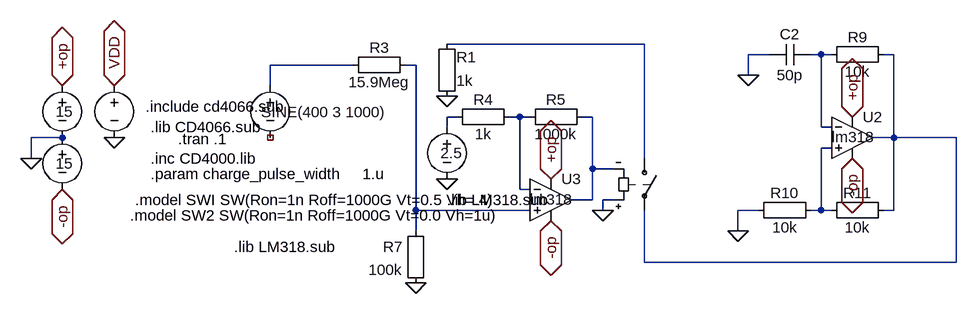
[diagram p0: schematic metal_SMPS_400v_100_pwm_control+generator.asc]
metal_SMPS_400v_100_pwm_control+generator.asc, the LTspice schematic file:
Version 4
SHEET 1 6068 1612
WIRE 3568 -3088 3264 -3088
WIRE 3760 -3072 3728 -3072
WIRE 3840 -3072 3824 -3072
WIRE 3856 -3072 3840 -3072
WIRE 3952 -3072 3936 -3072
WIRE 3120 -3056 2992 -3056
WIRE 3216 -3056 3200 -3056
WIRE 3728 -3040 3728 -3072
WIRE 2992 -3024 2992 -3056
WIRE 3280 -2976 3264 -2976
WIRE 3376 -2976 3360 -2976
WIRE 3392 -2976 3376 -2976
WIRE 3488 -2976 3472 -2976
WIRE 3264 -2960 3264 -2976
WIRE 3840 -2960 3840 -3072
WIRE 3856 -2960 3840 -2960
WIRE 2672 -2944 2624 -2944
WIRE 3952 -2944 3952 -3072
WIRE 3952 -2944 3920 -2944
WIRE 4048 -2944 3952 -2944
WIRE 3856 -2928 3840 -2928
WIRE 2624 -2912 2624 -2944
WIRE 3568 -2912 3568 -3088
WIRE 3488 -2896 3488 -2976
WIRE 3520 -2896 3488 -2896
WIRE 3376 -2864 3376 -2976
WIRE 3392 -2864 3376 -2864
WIRE 3488 -2848 3488 -2896
WIRE 3488 -2848 3456 -2848
WIRE 3520 -2848 3504 -2848
WIRE 3216 -2832 3216 -3056
WIRE 3392 -2832 3216 -2832
WIRE 3504 -2832 3504 -2848
WIRE 3744 -2832 3712 -2832
WIRE 3840 -2832 3840 -2928
WIRE 3840 -2832 3824 -2832
WIRE 3856 -2832 3840 -2832
WIRE 3952 -2832 3952 -2944
WIRE 3952 -2832 3936 -2832
WIRE 3216 -2800 3216 -2832
WIRE 3712 -2800 3712 -2832
WIRE 3568 -2752 3568 -2832
WIRE 4048 -2752 4048 -2944
WIRE 4048 -2752 3568 -2752
FLAG 2752 -2944 0
FLAG 2752 -3024 VDD
IOPIN 2752 -3024 BiDir
FLAG 3424 -2880 +op
IOPIN 3424 -2880 BiDir
FLAG 3424 -2816 -op
IOPIN 3424 -2816 BiDir
FLAG 2624 -2912 0
FLAG 2672 -3024 +op
IOPIN 2672 -3024 BiDir
FLAG 2672 -2864 -op
IOPIN 2672 -2864 BiDir
FLAG 3264 -2880 0
FLAG 3216 -2720 0
FLAG 3504 -2832 0
FLAG 3264 -3008 0
FLAG 3888 -2976 +op
IOPIN 3888 -2976 BiDir
FLAG 3888 -2912 -op
IOPIN 3888 -2912 BiDir
FLAG 3728 -3040 0
FLAG 3712 -2800 0
SYMBOL voltage 2752 -3040 R0
WINDOW 39 0 0 Left 2
WINDOW 0 24 16 Invisible 2
WINDOW 3 24 96 Invisible 2
SYMATTR InstName V7
SYMATTR Value 5
SYMBOL Opamps\\opamp2 3424 -2912 R0
WINDOW 3 -32 63 Left 2
SYMATTR Value lm318
SYMATTR InstName U3
SYMBOL voltage 2672 -2960 R0
WINDOW 0 24 16 Invisible 2
WINDOW 3 -10 56 Left 2
SYMATTR InstName V2
SYMATTR Value 15
SYMATTR SpiceLine Rser=0
SYMBOL voltage 2672 -3040 R0
WINDOW 0 24 16 Invisible 2
WINDOW 3 -10 56 Left 2
SYMATTR InstName V1
SYMATTR Value 15
SYMATTR SpiceLine Rser=0
SYMBOL Misc\\EuropeanResistor 3216 -3040 M270
WINDOW 0 27 56 VTop 2
WINDOW 3 5 56 VBottom 2
SYMATTR InstName R3
SYMATTR Value 15.9Meg
SYMBOL Misc\\EuropeanResistor 3376 -2960 M270
WINDOW 0 27 56 VTop 2
WINDOW 3 5 56 VBottom 2
SYMATTR InstName R4
SYMATTR Value 1k
SYMBOL Misc\\EuropeanResistor 3488 -2960 M270
WINDOW 0 27 56 VTop 2
WINDOW 3 5 56 VBottom 2
SYMATTR InstName R5
SYMATTR Value 1000k
SYMBOL voltage 3264 -2976 R0
WINDOW 0 24 16 Invisible 2
WINDOW 3 -10 56 Left 2
WINDOW 123 0 0 Left 2
SYMATTR InstName V3
SYMATTR Value 2.5
SYMATTR SpiceLine Rser=0
SYMBOL Misc\\EuropeanResistor 3232 -2816 M0
SYMATTR InstName R7
SYMATTR Value 100k
SYMBOL sw 3568 -2928 R0
WINDOW 0 13 4 Invisible 2
SYMATTR InstName S2
SYMATTR SpiceModel SW2
SYMATTR Value ""
SYMBOL Misc\\EuropeanResistor 3248 -2992 M180
WINDOW 0 31 76 Left 2
WINDOW 3 31 40 Left 2
SYMATTR InstName R1
SYMATTR Value 1k
SYMBOL Opamps\\opamp2 3888 -3008 R0
WINDOW 3 -32 63 Left 2
SYMATTR Value lm318
SYMATTR InstName U2
SYMBOL Misc\\EuropeanResistor 3952 -3056 M270
WINDOW 0 27 56 VTop 2
WINDOW 3 5 56 VBottom 2
SYMATTR InstName R9
SYMATTR Value 10k
SYMBOL Misc\\EuropeanResistor 3840 -2816 M270
WINDOW 0 27 56 VTop 2
WINDOW 3 5 56 VBottom 2
SYMATTR InstName R10
SYMATTR Value 10k
SYMBOL Misc\\EuropeanResistor 3952 -2816 M270
WINDOW 0 27 56 VTop 2
WINDOW 3 5 56 VBottom 2
SYMATTR InstName R11
SYMATTR Value 10k
SYMBOL Misc\\EuropeanCap 3824 -3088 R90
WINDOW 0 0 32 VBottom 2
WINDOW 3 32 32 VTop 2
SYMATTR InstName C2
SYMATTR Value 50p
SYMATTR SpiceLine Rser=.0008
SYMBOL voltage 2992 -3040 R0
WINDOW 123 0 0 Left 2
WINDOW 0 24 16 Invisible 2
WINDOW 3 -14 57 Left 2
SYMATTR InstName V4
SYMATTR Value SINE(400 3 1000)
SYMATTR SpiceLine Rser=0
TEXT 2784 -2848 Left 2 !.model SWI SW(Ron=1n Roff=1000G Vt=0.5 Vh=.4)
TEXT 3264 -2848 Left 2 !.lib LM318.sub
TEXT 2776 -2824 Left 2 !.model SW2 SW(Ron=1n Roff=1000G Vt=0.0 Vh=1u)
TEXT 2808 -2888 Left 2 !.param charge_pulse_width     1.u
TEXT 2936 -2776 Left 2 !.lib LM318.sub
TEXT 2808 -2960 Left 2 !.lib CD4066.sub
TEXT 2808 -2912 Left 2 !.inc CD4000.lib
TEXT 2800 -2992 Left 2 !.include cd4066.sub
TEXT 2850 -2942 Left 2 !.tran .1

The netlist it stands for:
* metal_SMPS_400v_100_pwm_control+generator.asc
V7 VDD 0 5
XU3 N005 N007 +op -op N008 lm318  ; pins In+ In- V+ V- OUT
V2 0 -op 15 Rser=0
V1 +op 0 15 Rser=0
R3 N005 N004 15.9Meg
R4 N007 N006 1k
R5 N008 N007 1000k
V3 N006 0 2.5 Rser=0
R7 N005 0 100k
S2 N001 N003 0 N008 SW2
R1 0 N001 1k
XU2 N009 N002 +op -op N003 lm318  ; pins In+ In- V+ V- OUT
R9 N003 N002 10k
R10 N009 0 10k
R11 N003 N009 10k
C2 N002 0 50p Rser=.0008
V4 N004 NC_01 SINE(400 3 1000) Rser=0
.model SWI SW(Ron=1n Roff=1000G Vt=0.5 Vh=.4)
.lib LM318.sub
.model SW2 SW(Ron=1n Roff=1000G Vt=0.0 Vh=1u)
.param charge_pulse_width     1.u
.lib LM318.sub
.lib CD4066.sub
.inc CD4000.lib
.include cd4066.sub
.tran .1
.backanno
.end